# Altium project Environmental_unit.PrjPcb (part 2 of 2)

## Sheet BatteryManagement.SchDoc
size A4; SheetNumber: 5; SheetTotal: 13
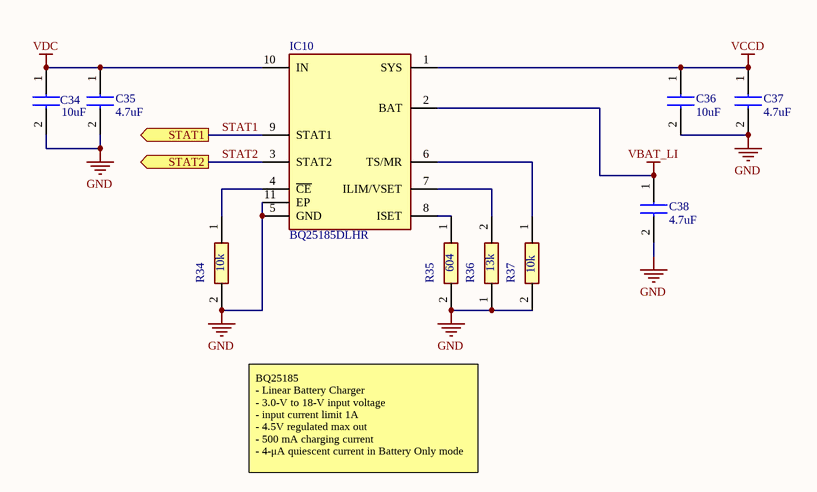
[diagram p7: BatteryManagement.SchDoc]

### Parts
C34  10uF  [GRM18x]
C35  4.7uF  [CAPC1608X90N]
C36  10uF  [GRM18x]
C37  4.7uF  [CAPC1608X90N]
C38  4.7uF  [CAPC1608X90N]
IC10  BQ25185DLHR  [SON40P220X200X80-11N]
R34  10k  [RESC1005X35N]
R35  604  [RESC1005X35N]
R36  13k  [RESC1005X35N]
R37  10k  [RESC1005X35N]

### Ports
STAT1 (out, see Power[2B]), STAT2 (out, see Power[2B])

### Nets
GND: C34.2 C35.2 C36.2 C37.2 C38.2 IC10.5(GND) IC10.11(EP) R34.2 R35.2 R36.1 R37.2
VBAT_LI: C38.1 IC10.2(BAT)
VCCD: C36.1 C37.1 IC10.1(SYS)
VDC: C34.1 C35.1 IC10.10(IN)
STAT1: IC10.9(STAT1) ; port STAT1
STAT2: IC10.3(STAT2) ; port STAT2
NetIC10_4: IC10.4(~{CE}) R34.1
NetIC10_6: IC10.6(TS/MR) R37.1
NetIC10_7: IC10.7(ILIM/VSET) R36.2
NetIC10_8: IC10.8(ISET) R35.1

### Notes on the sheet
- BQ25185
  - Linear Battery Charger
  - 3.0-V to 18-V input voltage
  - input current limit 1A
  - 4.5V regulated max out
  - 500 mA charging current
  - 4-μA quiescent current in Battery Only mode
- Title:
- Date:
- Project:
- Type:
- Schematic
- Variant:
- Revision:
- Sheet
- of
- Author:
- Evžen Šteif
- Size:
- A4

### Library data of the parts
C34 C36 = GRM188R61E106KA73D: Capacitor; Manufacturer_Name: Murata Electronics; Datasheet Link: https://search.murata.co.jp/Ceramy/image/img/A01X/G101/ENG/GRM188R61E106KA73-01A.pdf; Height: 0.9mm; Manufacturer_Part_Number: GRM188R61E106KA73D; Mouser Part Number: 81-GRM188R61E106KA3D; Mouser Price/Stock: https://www.mouser.co.uk/ProductDetail/Murata-Electronics/GRM188R61E106KA73D?qs=5aG0NVq1C4z8ebxPkQZf9A%3D%3D; Arrow Part Number: GRM188R61E106KA73D; Arrow Price/Stock: https://www.arrow.com/en/products/grm188r61e106ka73d/murata-manufacturing?region=nac
C35 C37 C38 = GRM188R61E475KE11J: Capacitor; Manufacturer_Name: Murata Electronics; Datasheet Link: https://search.murata.co.jp/Ceramy/image/img/A01X/G101/ENG/GRM188R61E475KE11-01A.pdf; Height: 0.9mm; Manufacturer_Part_Number: GRM188R61E475KE11J; Mouser Part Number: 81-GRM188R61E475KE1J; Mouser Price/Stock: https://www.mouser.co.uk/ProductDetail/Murata-Electronics/GRM188R61E475KE11J?qs=hNud%2FORuBR3%2Fa9GLJFT8KA%3D%3D; Arrow Part Number: GRM188R61E475KE11J; Arrow Price/Stock: https://www.arrow.com/en/products/grm188r61e475ke11j/murata-manufacturing
IC10 = BQ25185DLHR: Integrated Circuit; Manufacturer_Name: Texas Instruments; Datasheet Link: https://www.ti.com/lit/ds/symlink/bq25185.pdf?ts=1706857561339&ref_url=https%253A%252F%252Fwww.ti.com%252Fproduct%252FBQ25185; Height: 0.8mm; Manufacturer_Part_Number: BQ25185DLHR; Mouser Part Number: 595-BQ25185DLHR; Mouser Price/Stock: https://www.mouser.co.uk/ProductDetail/Texas-Instruments/BQ25185DLHR?qs=Z%252BL2brAPG1IbO%2FV3RqsaPw%3D%3D
R34 R37 = RT0402FRE0710KL: Resistor; Manufacturer_Name: KEMET; Datasheet Link: https://cz.mouser.com/datasheet/2/447/PYu_RT_1_to_0_01_RoHS_L_15-3461507.pdf; Height: 0.35mm; Manufacturer_Part_Number: RT0402FRE0710KL; Mouser Part Number: 603-RT0402FRE0710KL; Mouser Price/Stock: https://www.mouser.co.uk/ProductDetail/YAGEO/RT0402FRE07100KL?qs=BXCcY9r%252B08CxTvf5JB1kiw%3D%3D; Arrow Part Number: RT0402FRE07100KL; Arrow Price/Stock: https://www.arrow.com/en/products/rt0402fre07100kl/yageo
R35 = RT0402BRD07604RL: Resistor; Manufacturer_Name: KEMET; Datasheet Link: https://cz.mouser.com/datasheet/2/447/PYu_RT_1_to_0_01_RoHS_L_15-3461507.pdf; Height: 0.35mm; Manufacturer_Part_Number: RT0402BRD07604RL; Mouser Part Number: 603-RT0402BRD0713KL; Mouser Price/Stock: https://www.mouser.com/Search/Refine.aspx?Keyword=603-RT0402BRD0713KL; Arrow Part Number: RT0402BRD0713KL; Arrow Price/Stock: https://www.arrow.com/en/products/rt0402brd0713kl/yageo
R36 = RT0402BRD0713KL: Resistor; Manufacturer_Name: KEMET; Datasheet Link: https://www.yageo.com/upload/media/product/productsearch/datasheet/rchip/PYu-RT_1-to-0.01_RoHS_L_12.pdf; Height: 0.35mm; Manufacturer_Part_Number: RT0402BRD0713KL; Mouser Part Number: 603-RT0402BRD0713KL; Mouser Price/Stock: https://www.mouser.com/Search/Refine.aspx?Keyword=603-RT0402BRD0713KL; Arrow Part Number: RT0402BRD0713KL; Arrow Price/Stock: https://www.arrow.com/en/products/rt0402brd0713kl/yageo

## Sheet Mechanical.SchDoc
size A4; SheetNumber: 13; SheetTotal: 13
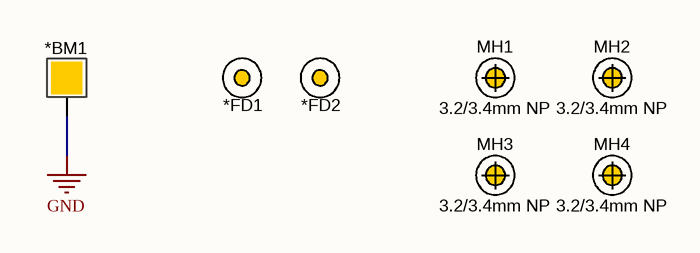
[diagram p8: Mechanical.SchDoc]

### Parts
*BM1  BADMARK  [BADMARK_BIG]  (value not drawn)
*FD1  FIDUCIAL  [FIDUCIAL]  (value not drawn)
*FD2  FIDUCIAL  [FIDUCIAL]  (value not drawn)
MH1  3.2/3.4mm NP  [TH_MH3.2/3.4NP]  (no BOM)
MH2  3.2/3.4mm NP  [TH_MH3.2/3.4NP]  (no BOM)
MH3  3.2/3.4mm NP  [TH_MH3.2/3.4NP]  (no BOM)
MH4  3.2/3.4mm NP  [TH_MH3.2/3.4NP]  (no BOM)

### Nets
GND: *BM1.1

Not connected (* = marked no-connect by the designer): *FD1 1; *FD2 1

### Notes on the sheet
- Title:
- Date:
- Project:
- Type:
- Schematic
- Variant:
- Revision:
- Sheet
- of
- Author:
- Evžen Šteif
- Size:
- A4

### Library data of the parts
*BM1 = MCH_00111: Manufacturer: LE; Autor: JA; Designer: Krahulec; Active: 1; Sourcing: None; Generic_replacement: No; Count: 0; LE_Price: 0.000000; LastRevisionDate: 14.5.2018; LastRevisionSvnBuild: *; Value: BADMARK; PartNumber: MCH_00111; Technology: NOP; Librarian: Krahulec; ComponentLink1URL: http://www.logicelements.cz; ComponentLink1Description: Manufacturer Web; Cat1: Badmark; ROHS: 1; Jablotron_Price: 0; Location: LE
*FD1 *FD2 = MCH_00028: Autor: Lukas Krahulec; Jablotron_Price: 0; Location: LE; Active: 1; Temperature_Min: -55; Temperature_Max: 125; TemperatureRange: Military; Sourcing: None; Generic_replacement: No; LatestRevisionDate: 25.6.2018; Value: Fiducial; PartNumber: MCH_00028; LE_Price: 0; Technology: NOP; Designer: Lukas Krahulec; Librarian: Lukas Krahulec; Manufacturer: LE; FIT: 0; ComponentLink1URL: http://www.logicelements.cz; ComponentLink1Description: Manufacturer Web; Cat1: Fiducial; ROHS: 1; Storage_Count: 0
MH1-MH4 = MCH_00037: (Mount Hole 3.2mm); Autor: Lukas Krahulec; Jablotron_Price: 0; Location: LE; Active: 1; Temperature_Min: -55; Temperature_Max: 125; TemperatureRange: Military; Cat1: Mounting Holes; Cat2: Non-Plated; Sourcing: None; Generic_replacement: No; LatestRevisionDate: 24.2.2020; Value: 3.2/3.4mm NP; PartNumber: MCH_00037; LE_Price: 0; Technology: NOP; Designer: Lukas Krahulec; Librarian: Lukas Krahulec; Manufacturer: LE; FIT: 0; ComponentLink1URL: http://www.logicelements.cz; ComponentLink1Description: Manufacturer Web; Cat3: 3.2 mm; ROHS: 1; Storage_Count: 0

## Nets that join several sheets
3V3: main (7 pins), MCU (16 pins)
+5V: USBtoUART (5 pins), Power (D9.2 LED6.2)
GND: main (11 pins), USBtoUART (20 pins), NFC (C26.1 C28.2 IC9.4), EInkHeader (17 pins), MCU (18 pins), RFHeader (D2.3 D3.3 J1.8 J2.8), Power (12 pins), BatteryManagement (11 pins), Mechanical (*BM1.1)
P3V3: main (LED3.2 LED4.2), USBtoUART (7 pins)
VBAT_LI: Power (J6.1), BatteryManagement (C38.1 IC10.2)
VCCD: Power (D10.2 R28.1), BatteryManagement (C36.1 C37.1 IC10.1)
VDC: Power (D8.1 D9.1), BatteryManagement (C34.1 C35.1 IC10.10)
VIN: RFHeader (J2.7), Power (5 pins)
BUSY: EInkHeader (J9.9), MCU (IC3.26)
BUTTON: main (C29.2 R23.1), MCU (IC3.30)
CS: EInkHeader (J9.12), MCU (IC3.22)
DBG_RX: USBtoUART (R6.1), MCU (IC3.15)
DBG_TX: USBtoUART (R8.1), MCU (IC3.14)
DC: EInkHeader (J9.11), MCU (IC3.24)
DIN: EInkHeader (J9.14), MCU (IC3.23)
EPD_RST: EInkHeader (J9.10), MCU (IC3.25)
EPD_SCK: EInkHeader (J9.13), MCU (IC3.21)
GPO: main (R22.1), NFC (IC9.7), MCU (IC3.56)
LED: main (R49.1), MCU (IC3.29)
NetIC3_17: main (R20.2), MCU (IC3.17)
NetIC3_20: main (R48.2), MCU (IC3.20)
NetIC3_61: main (R19.2), MCU (IC3.61)
PS1: MCU (IC3.51), Power (R30.2)
PS2: MCU (IC3.52), Power (R31.2)
PS3: MCU (IC3.53), Power (R32.2)
PS4: MCU (IC3.54), Power (R33.2)
RF_CS: MCU (IC3.41), RFHeader (RN1.14)
RF_GPIO0: MCU (IC3.39), RFHeader (RN1.16)
RF_GPIO1: MCU (IC3.37), RFHeader (RN2.1)
RF_GPIO2: MCU (IC3.38), RFHeader (RN2.2)
RF_MISO: MCU (IC3.35), RFHeader (RN1.12)
RF_MOSI: MCU (IC3.36), RFHeader (RN1.11)
RF_RTS: MCU (IC3.40), RFHeader (RN1.15)
RF_RX: MCU (IC3.43), RFHeader (RN2.3)
RF_SCK: MCU (IC3.34), RFHeader (RN1.13)
RF_TX: MCU (IC3.42), RFHeader (RN2.4)
RST: main (C30.2 K1.10 R26.1), MCU (IC3.7)
SCL: main (R17.1), NFC (IC9.6), MCU (IC3.58), RFHeader (RN2.5)
SDA: main (R18.1), NFC (IC9.5), MCU (IC3.59), RFHeader (RN2.6)
STAT1: main (R14.2 R20.1), BatteryManagement (IC10.9)
STAT2: main (R15.2 R48.1), BatteryManagement (IC10.3)
SWDCLK: main (K1.4), MCU (IC3.49)
SWDIO: main (K1.2), MCU (IC3.46)
USB_ON: USBtoUART (R13.1 R45.2), MCU (IC3.16)

## Assembly variants
EnvUnit_assembly: not fitted C26 C28 J4 R30 R31 R32 R33